# Altium schematic sheet alu_raspberrypi_micro.SchDoc
size A; SheetNumber: 4; SheetTotal: 4
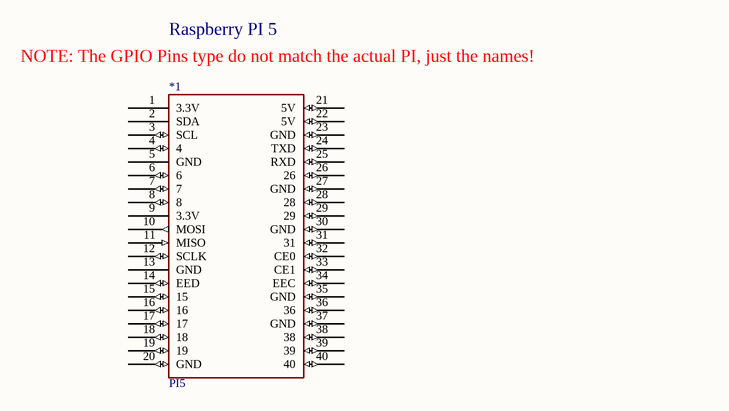
[diagram p0: alu_raspberrypi_micro.SchDoc]

## Parts
*1  PI5

## Nets

Not connected (* = marked no-connect by the designer): *1 1(3.3V) 2(SDA) 3(SCL) 4 5(GND) 6 7 8 9(3.3V) 10(MOSI) 11(MISO) 12(SCLK) 13(GND) 14(EED) 15 16 17 18 19 20(GND) 21(5V) 22(5V) 23(GND) 24(TXD) 25(RXD) 26 27(GND) 28 29 30(GND) 31 32(CE0) 33(CE1) 34(EEC) 35(GND) 36 37(GND) 38 39 40

## Notes on the sheet
- Raspberry PI 5
- (near *1) NOTE: The GPIO Pins type do not match the actual PI, just the names!